# EAGLE design biggity (EAGLE 9.1.1)
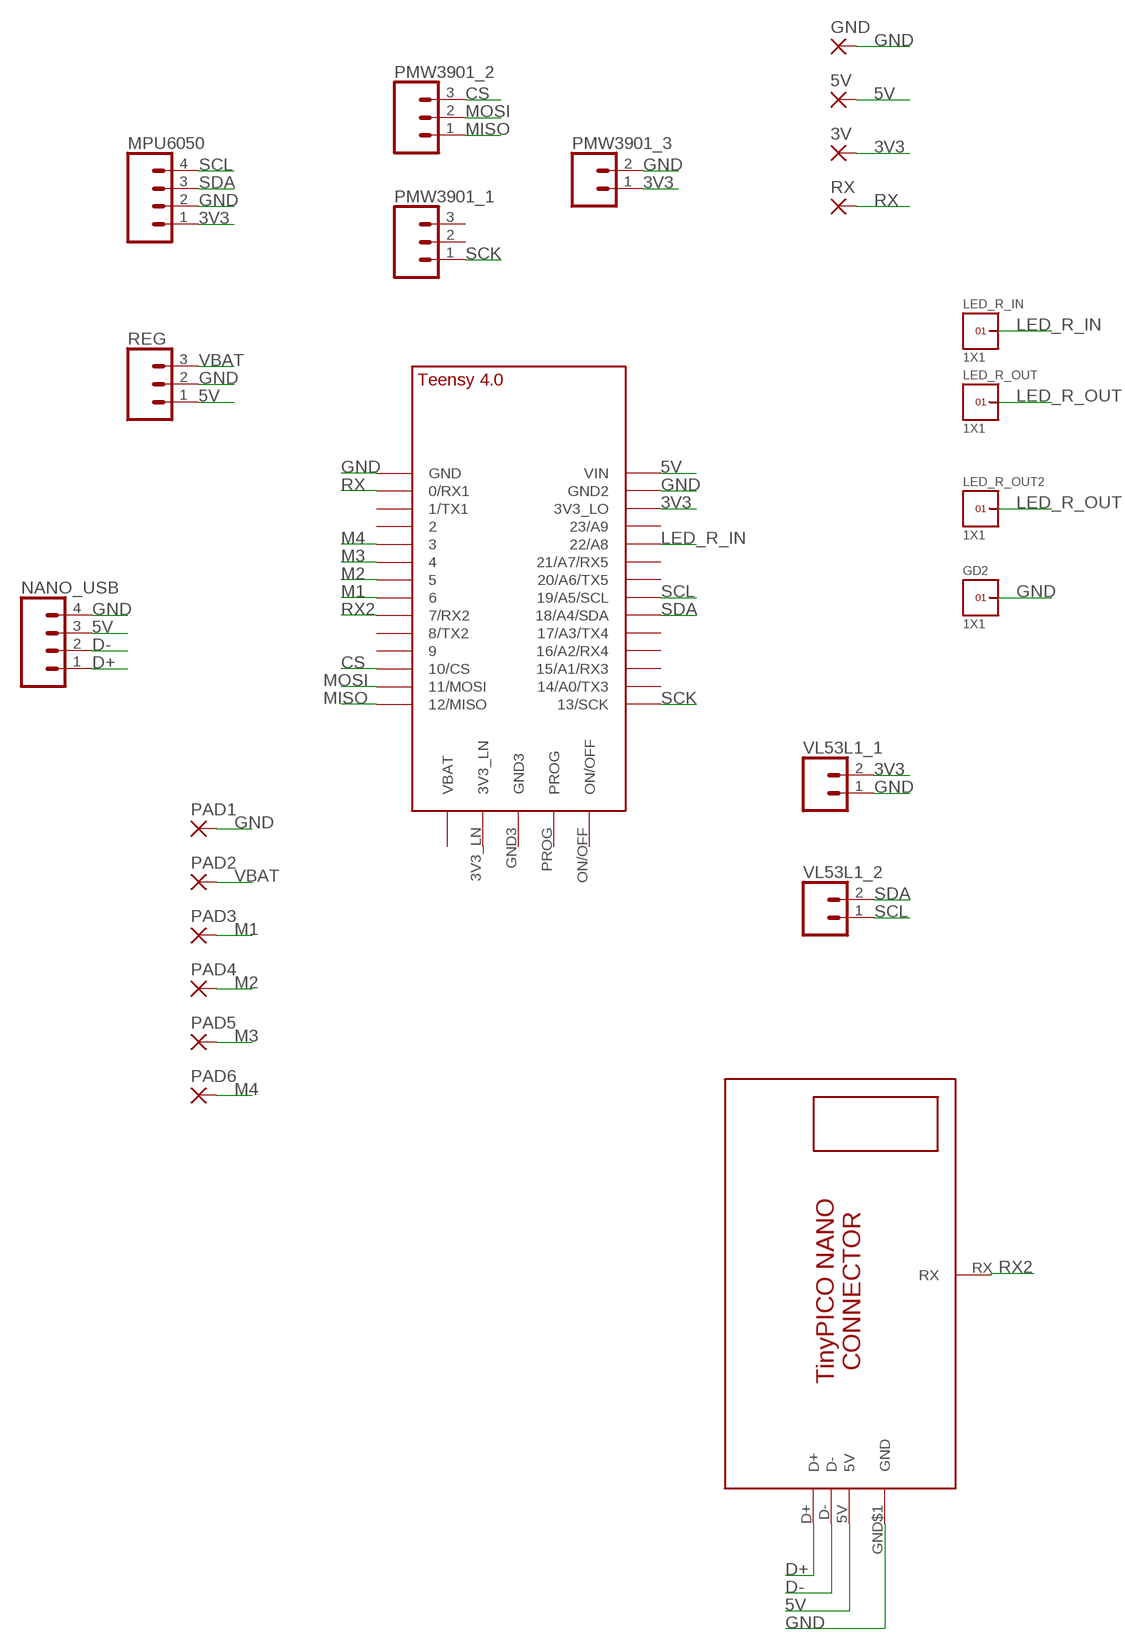
[diagram p0: schematic, sheet 1]

## Parts
3V  SMD2  [SMD1,27-2,54]
5V  SMD2  [SMD1,27-2,54]
GD2  1X1  [1X1]
GND  SMD2  [SMD1,27-2,54]
LED_R_IN  1X1  [1X1]
LED_R_OUT  1X1  [1X1]
LED_R_OUT2  1X1  [1X1]
MPU6050  CONN_041X04_NO_SILK  [1X04_NO_SILK]
NANO_USB  CONN_041X04_NO_SILK  [1X04_NO_SILK]
PAD1  SMD2  [SMD1,27-2,54]
PAD2  SMD2  [SMD1,27-2,54]
PAD3  SMD2  [SMD1,27-2,54]
PAD4  SMD2  [SMD1,27-2,54]
PAD5  SMD2  [SMD1,27-2,54]
PAD6  SMD2  [SMD1,27-2,54]
PMW3901_1  CONN_031X03_NO_SILK  [1X03_NO_SILK]
PMW3901_2  CONN_031X03_NO_SILK  [1X03_NO_SILK]
PMW3901_3  CONN_021X02_NO_SILK  [1X02_NO_SILK]
REG  CONN_031X03_NO_SILK  [1X03_NO_SILK]
RX  SMD2  [SMD1,27-2,54]
U$1  TEENSY_4.0  [TEENSY_4.0]
U$2  TINYPICO-NANO-CONNECTOR  [TINYPICO-NANO-CONNECTOR]
VL53L1_1  CONN_021X02_NO_SILK  [1X02_NO_SILK]
VL53L1_2  CONN_021X02_NO_SILK  [1X02_NO_SILK]

## Nets
3V3: 3V.1(P) MPU6050.1 PMW3901_3.1 U$1.3V3_LO VL53L1_1.2
5V: 5V.1(P) NANO_USB.3 REG.1 U$1.VIN U$2.5V
CS: PMW3901_2.3 U$1.10/CS
D+: NANO_USB.1 U$2.D+
D-: NANO_USB.2 U$2.D-
GND: GD2.1 GND.1(P) MPU6050.2 NANO_USB.4 PAD1.1(P) PMW3901_3.2 REG.2 U$1.GND U$1.GND2 U$2.GND$1(GND) VL53L1_1.1
LED_R_IN: LED_R_IN.1 U$1.22/A8
LED_R_OUT: LED_R_OUT2.1 LED_R_OUT.1
M1: PAD3.1(P) U$1.6
M2: PAD4.1(P) U$1.5
M3: PAD5.1(P) U$1.4/CANRX
M4: PAD6.1(P) U$1.3/CANTX
MISO: PMW3901_2.1 U$1.12/MISO
MOSI: PMW3901_2.2 U$1.11/MOSI
RX: RX.1(P) U$1.0/RX(0/RX1)
RX2: U$1.7(7/RX2) U$2.RX
SCK: PMW3901_1.1 U$1.13/SCK
SCL: MPU6050.4 U$1.19/A5/SCL VL53L1_2.1
SDA: MPU6050.3 U$1.18/A4/SDA VL53L1_2.2
VBAT: PAD2.1(P) REG.3
Unconnected: PMW3901_1.2 PMW3901_1.3 U$1.1/TX(1/TX1) U$1.2 U$1.3V3_LN U$1.8(8/TX2) U$1.9/CS U$1.14/A0(14/A0/TX3) U$1.15/A1(15/A1/RX3) U$1.16/A2(16/A2/RX4) U$1.17/A3(17/A3/TX4) U$1.20/A6(20/A6/TX5) U$1.21/A7(21/A7/RX5) U$1.23/A9 U$1.GND3 U$1.ON/OFF U$1.PROG U$1.VBAT\(VBAT)

## Library data of the parts
3V 5V GND PAD1-PAD6 RX = wirepad:SMD2: SMD PAD
GD2 LED_R_IN LED_R_OUT LED_R_OUT2 = headers(2mm):1X1
MPU6050 NANO_USB = SparkFun-Connectors:CONN_04: Multi connection point. Often used as Generic Header-pin footprint for 0.1 inch spaced/style header connections On any of the 0.1 inch spaced packages, you can populate with these: Break Away Headers - Straight <https://www.sparkfun.com/products/116> (PRT-00116) Break Away Male Headers - Right Angle <https://www.sparkfun.com/products/553> (PRT-00553) Female Headers <https://www.sparkfun.com/products/115> (PRT-00115) Break Away Headers - Machine Pin <https://www.sparkfun.com/products/117> (PRT-00117) Break Away Female Headers - Swiss Machine Pin <https://www.sparkfun.com/products/743> (PRT-00743) For SCREWTERMINALS and SPRING TERMINALS visit here: Screw Terimnals on SparkFun.com <https://www.sparkfun.com/search/results?term=Screw+Terminals> (5mm/3.5mm/2.54mm spacing) This device is also useful as a general connection point to wire up your design to another part of your project. Our various solder wires solder well into these plated through hole pads. Hook-Up Wire - Assortment (Stranded, 22 AWG) <https://www.sparkfun.com/products/11375> (PRT-11375) Hook-Up Wire - Assortment (Solid Core, 22 AWG) <https://www.sparkfun.com/products/11367> (PRT-11367) View the entire wire category on our website here <https://www.sparkfun.com/categories/141> Special notes: Molex polarized connector foot print use with SKU : PRT-08231 with associated crimp pins and housings. 1MM SMD Version SKU: PRT-10208; PROD_ID: CONN-09696
PMW3901_1 PMW3901_2 REG = SparkFun-Connectors:CONN_03: Multi connection point. Often used as Generic Header-pin footprint for 0.1 inch spaced/style header connections On any of the 0.1 inch spaced packages, you can populate with these: Break Away Headers - Straight <https://www.sparkfun.com/products/116> (PRT-00116) Break Away Male Headers - Right Angle <https://www.sparkfun.com/products/553> (PRT-00553) Female Headers <https://www.sparkfun.com/products/115> (PRT-00115) Break Away Headers - Machine Pin <https://www.sparkfun.com/products/117> (PRT-00117) Break Away Female Headers - Swiss Machine Pin <https://www.sparkfun.com/products/743> (PRT-00743) Stackable Header - 3 Pin (Female, 0.1") <https://www.sparkfun.com/products/13875> (PRT-13875) For SCREWTERMINALS and SPRING TERMINALS visit here: Screw Terimnals on SparkFun.com <https://www.sparkfun.com/search/results?term=Screw+Terminals> (5mm/3.5mm/2.54mm spacing) This device is also useful as a general connection point to wire up your design to another part of your project. Our various solder wires solder well into these plated through hole pads. Hook-Up Wire - Assortment (Stranded, 22 AWG) <https://www.sparkfun.com/products/11375> (PRT-11375) Hook-Up Wire - Assortment (Solid Core, 22 AWG) <https://www.sparkfun.com/products/11367> (PRT-11367) View the entire wire category on our website here <https://www.sparkfun.com/categories/141> Special notes: Molex polarized connector foot print use with SKU : PRT-08232 with associated crimp pins and housings.
PMW3901_3 VL53L1_1 VL53L1_2 = SparkFun-Connectors:CONN_02: Multi connection point. Often used as Generic Header-pin footprint for 0.1 inch spaced/style header connections On any of the 0.1 inch spaced packages, you can populate with these: Break Away Headers - Straight <https://www.sparkfun.com/products/116> (PRT-00116) Break Away Male Headers - Right Angle <https://www.sparkfun.com/products/553> (PRT-00553) Female Headers <https://www.sparkfun.com/products/115> (PRT-00115) Break Away Headers - Machine Pin <https://www.sparkfun.com/products/117> (PRT-00117) Break Away Female Headers - Swiss Machine Pin <https://www.sparkfun.com/products/743> (PRT-00743) For SCREWTERMINALS and SPRING TERMINALS visit here: Screw Terimnals on SparkFun.com <https://www.sparkfun.com/search/results?term=Screw+Terminals> (5mm/3.5mm/2.54mm spacing) This device is also useful as a general connection point to wire up your design to another part of your project. Our various solder wires solder well into these plated through hole pads. Hook-Up Wire - Assortment (Stranded, 22 AWG) <https://www.sparkfun.com/products/11375> (PRT-11375) Hook-Up Wire - Assortment (Solid Core, 22 AWG) <https://www.sparkfun.com/products/11367> (PRT-11367) View the entire wire category on our website here <https://www.sparkfun.com/categories/141> Special notes: Molex polarized connector foot print use with: PRT-08233 with associated crimp pins and housings. 2.54_SCREWTERM for use with PRT-10571. 3.5mm Screw Terminal footprints for PRT-08084 5mm Screw Terminal footprints for use with PRT-08432
U$1 = TEENSY 4.0:TEENSY_4.0
U$2 = nano:TINYPICO-NANO-CONNECTOR: TinyPICO NANO Footprint https://www.tinypico.com/tinypico-nano

## Board
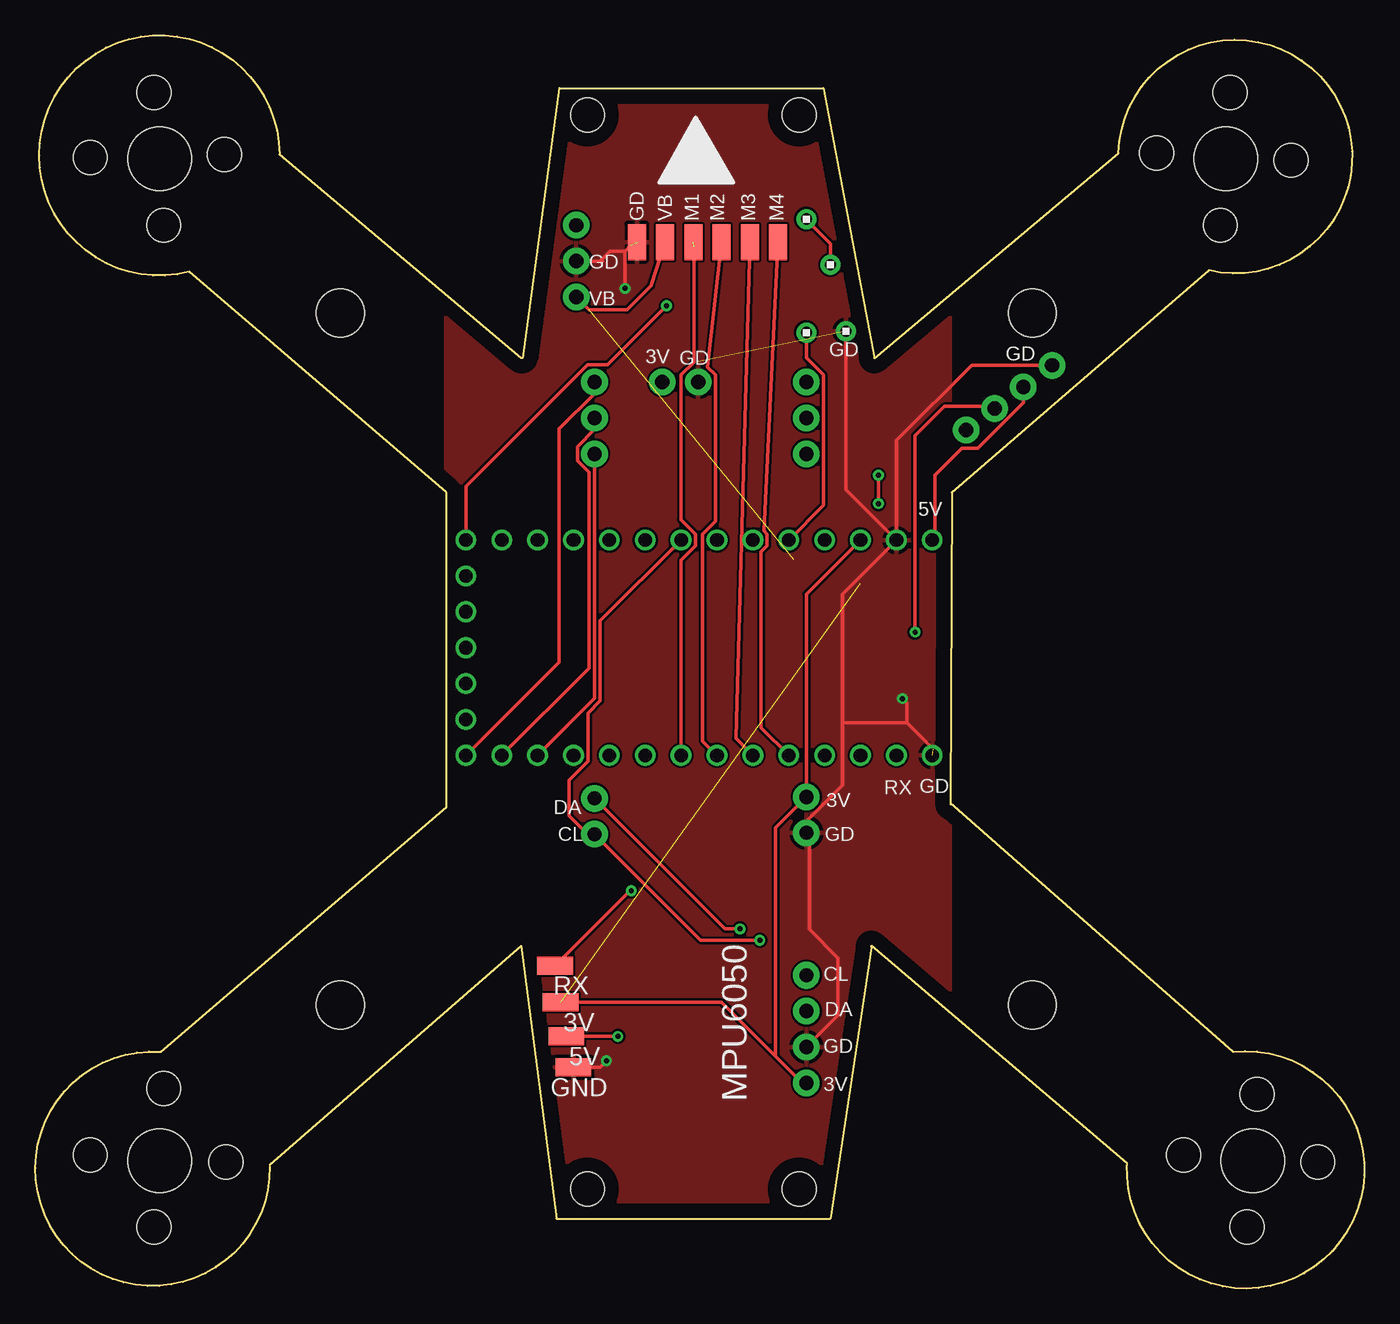
[diagram p1: board, top side]
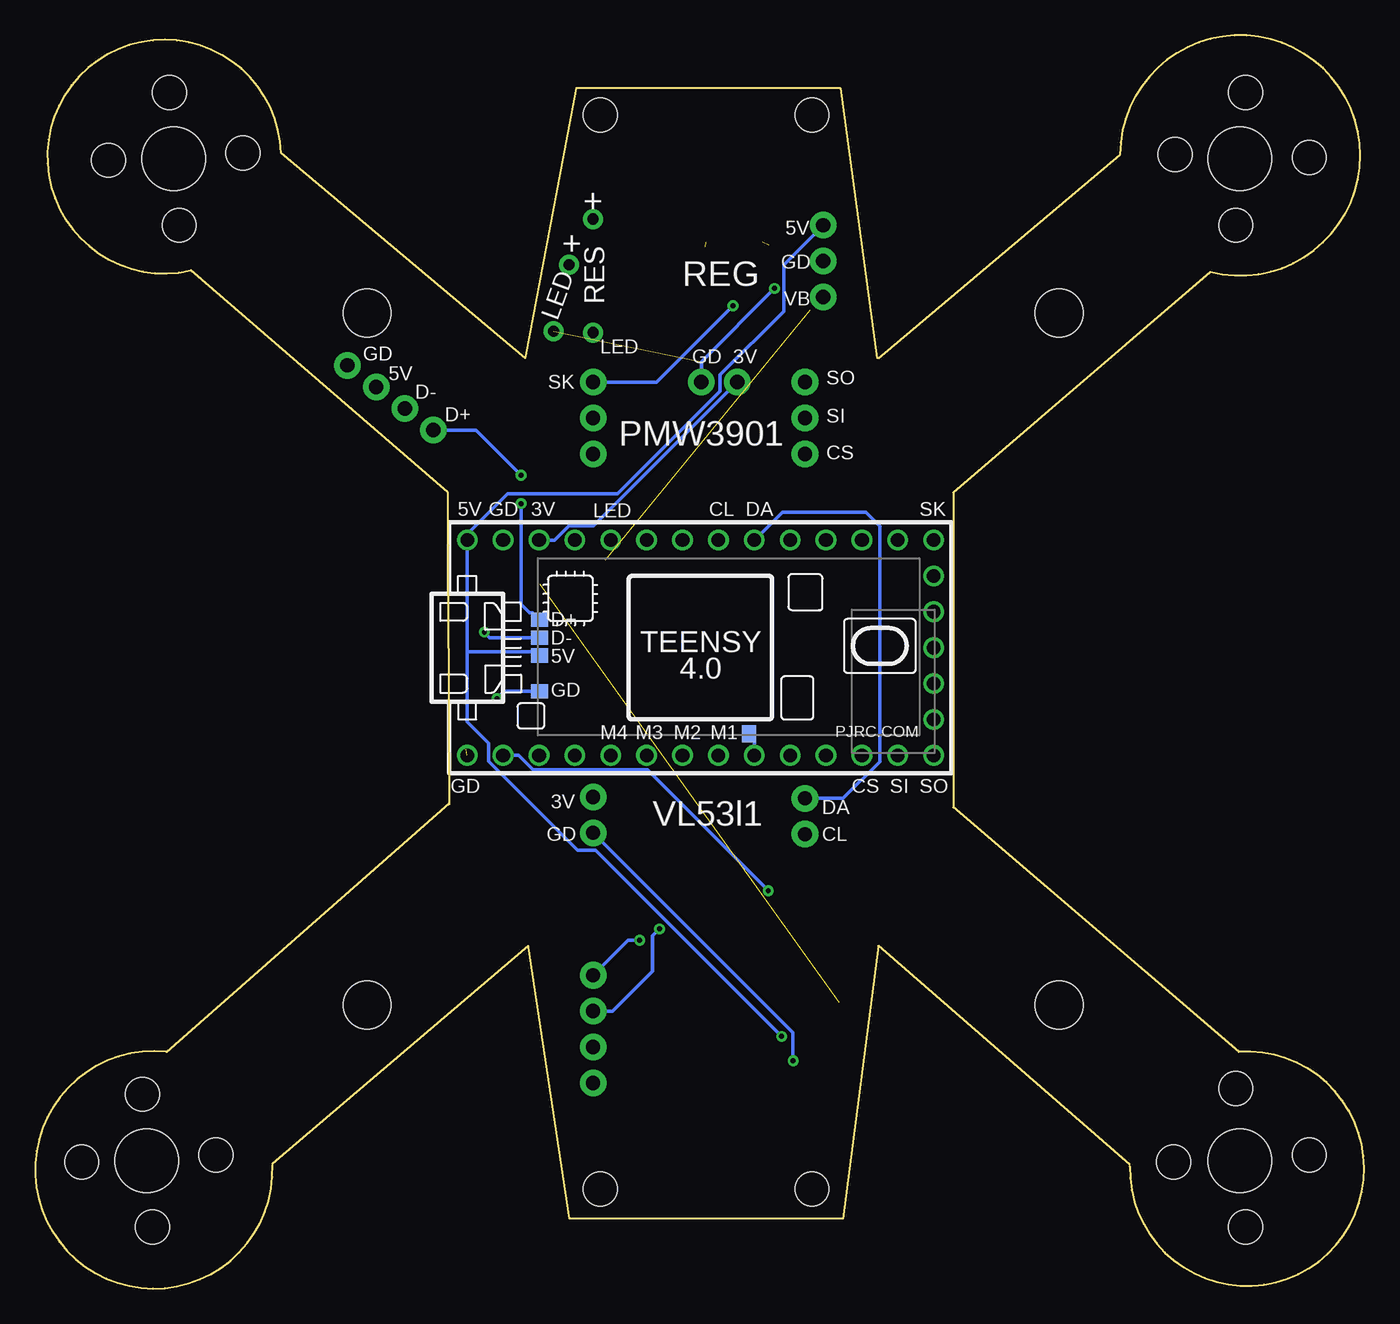
[diagram p2: board, bottom side, seen from below]

Size 94.08 x 88.7 mm. Coordinates in mm from the lower left corner, seen from the top.
Outline: 64.79,34.26 64.89,56.36 83.09,72.06 arc281 76.69,80.36 59.39,65.86 55.79,84.96 37.09,84.96 34.49,65.86
Outline: 59.19,24.16 56.29,4.96 36.89,4.96 34.39,24.26 16.59,8.76
Outline: 64.79,34.36 84.79,16.76 arc-279 77.29,8.76
Outline: 77.29,8.86 59.19,24.26
Outline: 34.39,65.86 17.29,80.26 arc284 10.89,71.96 29.09,56.36 29.09,34.06 8.89,16.76 arc275 16.59,8.66
Copper layers (1*16): Top 0.035mm / dielectric 1.5mm / Bottom 0.035mm
Design rules "default": minimum track width 6mil, minimum drill 0.35mm, track to track 6mil, track to pad 6mil, pad to pad 6mil, via to via 6mil, smd to smd 6mil, copper to edge 40mil, drill to drill 6mil, minimum pad ring 10mil, minimum via ring 8mil, stop-mask expansion 4mil, vias tented up to drill 0mil, thermal gap 10mil
Holes 2.4 mm at 39.09,7.06 54.09,83.06 39.09,83.06 54.09,7.06 84.59,84.66 83.89,75.26 79.39,80.36 88.89,79.86 8.39,84.66 9.09,75.26 3.89,80.06 13.39,80.26 86.49,13.76 85.79,4.36 81.29,9.46 90.79,8.96 9.09,14.16 8.39,4.36 3.89,9.46 13.49,8.96
Holes 4.5 mm at 84.29,79.96 8.79,79.96 86.19,9.06 8.79,9.06
Holes 3.4 mm at 21.59,69.06 70.59,69.06 70.59,20.06 21.59,20.06

### Footprints (pad centres in the part's own frame; a part is rotated, then mirrored left to right if it is on the bottom)
SMD1,27-2,54 = smd 1.27 x 2.54: 1 0,0
1X1 = drill 0.8 pad 1.422: 1 0,0
1X04_NO_SILK = drill 1.016 pad 1.88: 1 0,0; 2 2.54,0; 3 5.08,0; 4 7.62,0
1X03_NO_SILK = drill 1.016 pad 1.88: 1 0,0; 2 2.54,0; 3 5.08,0
1X02_NO_SILK = drill 1.016 pad 1.88: 1 0,0; 2 2.54,0
TEENSY_4.0 = drill 0.965: 0/RX -13.97,-7.62; 1/TX -11.43,-7.62; 2 -8.89,-7.62; 3/CANTX -6.35,-7.62; 3V3_LN 16.51,-2.54; 3V3_LO -11.43,7.62; 4/CANRX -3.81,-7.62; 5 -1.27,-7.62; 6 1.27,-7.62; 7 3.81,-7.62; 8 6.35,-7.62; 9/CS 8.89,-7.62; 10/CS 11.43,-7.62; 11/MOSI 13.97,-7.62; 12/MISO 16.51,-7.62; 13/SCK 16.51,7.62; 14/A0 13.97,7.62; 15/A1 11.43,7.62; 16/A2 8.89,7.62; 17/A3 6.35,7.62; 18/A4/SDA 3.81,7.62; 19/A5/SCL 1.27,7.62; 20/A6 -1.27,7.62; 21/A7 -3.81,7.62; 22/A8 -6.35,7.62; 23/A9 -8.89,7.62; GND -16.51,-7.62; GND2 -13.97,7.62; GND3 16.51,0; ON/OFF 16.51,5.08; PROG 16.51,2.54; VBAT\ 16.51,-5.08; VIN -16.51,7.62
TINYPICO-NANO-CONNECTOR = smd 1.2 x 1: 5V 0.1,5.645; D+ 0.1,8.185; D- 0.1,6.915; GND$1 0.1,3.105 | smd 1 x 1.2: RX 14.935,0.1

### Placement (x,y rotation side)
3V  37.19,20.26 90 top
5V  37.59,17.86 90 top
GD2  57.39,67.76 0 top
GND  38.09,15.66 90 top
LED_R_IN  54.59,67.66 0 top
LED_R_OUT  54.59,75.69 0 top
LED_R_OUT2  56.29,72.46 0 top
MPU6050  54.59,14.56 90 top
NANO_USB  65.89,60.76 37 top
PAD1  42.59,74.06 0 top
PAD2  44.59,74.06 0 top
PAD3  46.59,74.06 0 top
PAD4  48.59,74.06 0 top
PAD5  50.59,74.06 0 top
PAD6  52.59,74.06 0 top
PMW3901_1  54.59,64.16 270 top
PMW3901_2  39.59,64.16 270 top
PMW3901_3  44.39,64.16 0 top
REG  38.29,75.26 270 top
RX  36.79,22.86 90 top
U$1  46.99,45.36 0 bottom
U$2  58.49,39.16 0 bottom
VL53L1_1  54.59,32.26 90 top
VL53L1_2  39.59,32.16 90 top

### Tracks (layer width: path | path; a pad name or v marks a point on that pad's centre or on a via)
3V3  (1 unrouted)
  Top 0.254: U$1.3V3_LO 54.59,49.15 VL53L1_1.2 52.42,32.62 52.42,16.43 | 52.42,16.43 54.29,14.56 MPU6050.1 | 52.42,16.43 48.59,20.26 3V.1
  Bottom 0.254: PMW3901_3.1 54.56,53.99 56.3,53.99 57.32,52.98 U$1.3V3_LO
5V  (via drill 0.35)
  Top 0.254: v41.24,17.85 5V.1 | U$1.VIN 63.7,53.18 63.7,57.57 65.61,59.48 66.72,59.48 69.95,62.71 NANO_USB.3
  Bottom 0.254: 63.5,45.06 U$1.VIN 63.5,53.4 60.65,56.25 52.87,56.25 45.61,63.51 45.61,64.66 41.09,69.18 41.09,72.46 REG.1 | 63.5,45.06 63.5,40.11 61.98,38.58 61.98,37.32 55.7,31.04 54.43,31.04 v41.24,17.85 | U$2.5V 58.65,45.06 63.5,45.06
CS
  Top 0.254: PMW3901_2.3 39.59,41.77 U$1.10/CS
D+  (via drill 0.35)
  Top 0.254: v59.69,55.56 v59.69,57.56
  Bottom 0.254: U$2.D+ 58.88,47.83 59.11,47.83 59.69,48.42 v59.69,55.56 | v59.69,57.56 62.89,60.76 NANO_USB.1
D-  (via drill 0.35)
  Top 0.254: v62.29,46.46 62.29,60.36 64.36,62.44 67.77,62.44 NANO_USB.2
  Bottom 0.254: v62.29,46.46 61.91,46.07 U$2.D-
GND  (via drill 0.35)  (3 unrouted)
  Top 0.254: U$1.GND2 57.13,49.15 57.13,40.06 | 57.13,40.06 57.13,35.61 54.59,33.07 VL53L1_1.1 54.79,32.05 54.79,25.43 56.83,23.39 56.83,19.34 MPU6050.2 | v40.43,16.12 39.97,15.66 GND.1 | v41.75,70.78 41.75,73.42 | 41.75,73.42 42.16,73.83 | GD2.1 57.39,56.54 U$1.GND2 | 39.99,72.72 40.15,72.72 39.99,72.72 | 39.99,72.72 REG.2 | 39.99,72.72 40.7,73.42 41.75,73.42 | 57.13,40.06 61.69,40.06 | 61.69,40.06 63.59,38.16 | v61.39,41.76 61.69,41.46 61.69,40.06 | U$1.GND2 60.96,60.03 66.29,65.36 71.96,65.36 NANO_USB.4
  Bottom 0.254: VL53L1_1.1 40.43,18.1 v40.43,16.12 | PMW3901_3.2 46.93,65.6 v41.75,70.78 | U$2.GND$1 60.89,42.26 v61.39,41.76
  pour Top: 64.74,98.21 64.74,-3.49 29.09,-3.49 29.09,98.21
LED_R_IN
  Top 0.254: LED_R_IN.1 54.59,65.88 55.81,64.66 55.81,55.45 U$1.22/A8
LED_R_OUT
  Top 0.254: LED_R_OUT2.1 56.29,73.96 55.32,74.93 54.59,75.67 LED_R_OUT.1
M1  (1 unrouted)
  Top 0.254: 46.62,73.73 46.62,65.57 45.71,64.66 45.71,54.42 46.74,53.4 46.74,52.56 45.72,51.54 U$1.6
M2
  Top 0.254: U$1.5 47.25,38.75 47.25,53.4 48.15,54.3 48.15,64.66 47.59,65.22 PAD4.1
M3
  Top 0.254: PAD5.1 49.59,38.95 U$1.4/CANRX
M4
  Top 0.254: U$1.3/CANTX 51.39,39.69 51.39,52.13 51.82,52.56 51.82,53.4 51.59,53.62 PAD6.1
MISO
  Top 0.254: PMW3901_2.1 39.59,63.34 37.09,60.84 37.09,44.34 U$1.12/MISO
MOSI
  Top 0.254: U$1.11/MOSI 39.19,43.9 39.19,57.76 38.37,58.57 38.37,59.58 39.59,60.8 PMW3901_2.2
RX  (via drill 0.35)
  Top 0.254: RX.1 42.09,28.16 v42.19,28.16
  Bottom 0.254: v42.19,28.16 50.76,36.72 58.84,36.72 59.86,37.74 U$1.0/RX
RX2
  Bottom 0.254: U$2.RX 43.18,38.88 U$1.7
SCK  (via drill 0.35)
  Top 0.254: v44.69,69.56 40.51,65.38 39.09,65.38 30.48,56.77 U$1.13/SCK
  Bottom 0.254: PMW3901_1.1 50.09,64.16 v44.69,69.56
SCL  (via drill 0.35)
  Top 0.254: v51.29,24.66 47.09,24.66 VL53L1_2.1 39.09,32.16 37.79,33.46 37.79,35.99 39.12,37.32 39.12,40.72 40,41.6 40,47.25 U$1.19/A5/SCL
  Bottom 0.254: v51.29,24.66 52.11,24.66 MPU6050.4
SDA  (via drill 0.35)
  Top 0.254: VL53L1_2.2 48.83,25.46 v49.89,25.46
  Bottom 0.254: v49.89,25.46 50.39,24.96 50.39,22.46 53.21,19.64 MPU6050.3 | VL53L1_2.2 36.89,34.7 34.29,37.3 34.29,53.96 35.29,54.96 41.2,54.96 U$1.18/A4/SDA
VBAT  (1 unrouted)
  Top 0.254: REG.3 39.21,69.26 41.89,69.26 43.59,70.96 PAD2.1

### Text on the board
tNames: GD | VB | M1 | M2 | M3 | M4 | GD | VB | GD | GD | 3V | GD | 5V | RX | GD | 3V | DA | CL | GD | MPU6050 | CL | DA | GD | 3V
bNames: + | 5V | + | GD | REG | RES | VB | LED | LED | GD | 3V | GD | SO | SK | 5V | D- | SI | D+ | PMW3901 | CS | SK | DA | CL | LED | 3V | GD | 5V | D+ | D- | 5V | GD | M1 | M2 | M3 | M4 | SO | SI | CS | GD | 3V | DA | VL53l1 | CL | GD